# EAGLE schematic digital_sensor (EAGLE 7.1.0)
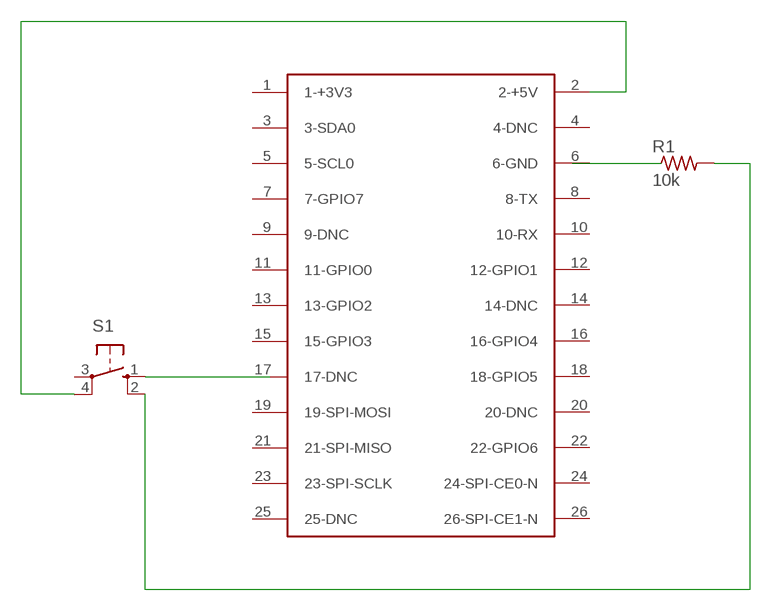
[diagram p0: schematic, sheet 1]

## Parts
R1  10k  R-US_0207/12  [0207/12]
S1  40-XX-ROUND  [B3F-40XX-ROUND]
U$1  RASPBERRY-PI  [RASPBERRY-PI]

## Nets
N$1: S1.1(S)
N$3: R1.2 S1.2(S1)
N$4: S1.4(P1) U$1.2(2-+5V)
Unconnected: R1.1 S1.3(P) U$1.1(1-+3V3) U$1.3(3-SDA0) U$1.4(4-DNC) U$1.5(5-SCL0) U$1.6(6-GND) U$1.7(7-GPIO7) U$1.8(8-TX) U$1.9(9-DNC) U$1.10(10-RX) U$1.11(11-GPIO0) U$1.12(12-GPIO1) U$1.13(13-GPIO2) U$1.14(14-DNC) U$1.15(15-GPIO3) U$1.16(16-GPIO4) U$1.17(17-DNC) U$1.18(18-GPIO5) U$1.19(19-SPI-MOSI) U$1.20(20-DNC) U$1.21(21-SPI-MISO) U$1.22(22-GPIO6) U$1.23(23-SPI-SCLK) U$1.24(24-SPI-CE0-N) U$1.25(25-DNC) U$1.26(26-SPI-CE1-N)

## Library data of the parts
R1 = adafruit:R-US_: RESISTOR, American symbol
S1 = adafruit:40-XX: OMRON SWITCH
U$1 = RaspberryPi:RASPBERRY-PI: Raspberry Pi Board <http://www.raspberrypi.org/> Jacques Lagnel V1.0 (beta) 2012 Board dimension: Forum 3D model <http://www.raspberrypi.org/forum/general-discussion/mechanical-profile-3d-models?value=3d%20model&type=1&include=1&search=1&ret=all> The GPIO Connector (P1): http://elinux.org/RPi_Low-level_peripherals